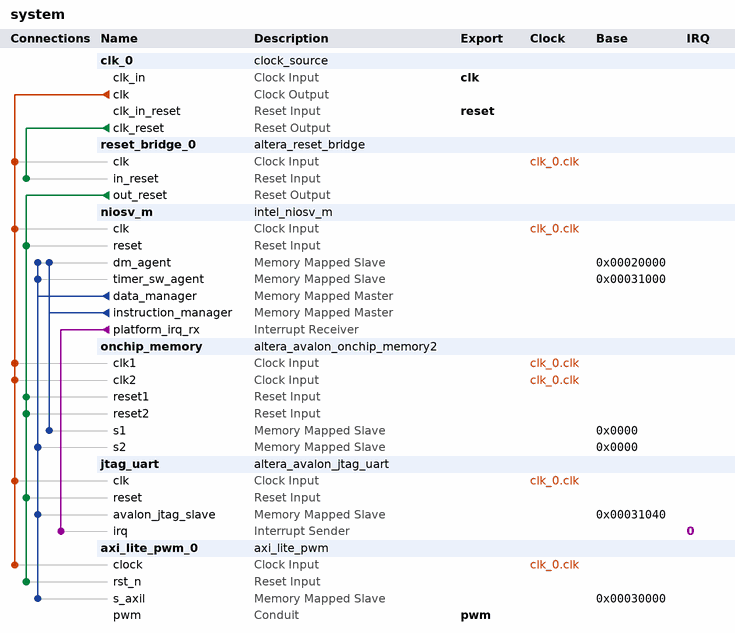
[diagram p0: system contents]
# Platform Designer (Qsys) system system, MAX 10 10M50DAF484C7G
# Parameters at their usual value, and those the tool derives, are not listed.
package require -exact qsys 25.1
create_system system
set_project_property DEVICE_FAMILY {MAX 10}
set_project_property DEVICE 10M50DAF484C7G

add_instance clk_0 clock_source 25.1
set_instance_parameter_value clk_0 clockFrequency 50000000

add_instance reset_bridge_0 altera_reset_bridge 25.1
set_instance_parameter_value reset_bridge_0 ACTIVE_LOW_RESET 1
set_instance_parameter_value reset_bridge_0 SYNCHRONOUS_EDGES deassert

add_instance niosv_m intel_niosv_m 26.0.0
set_instance_parameter_value niosv_m enableAvalonInterface false
set_instance_parameter_value niosv_m enableDebugReset false
set_instance_parameter_value niosv_m enableECCFull false
set_instance_parameter_value niosv_m enableECCLite false
set_instance_parameter_value niosv_m hartId 0
set_instance_parameter_value niosv_m interruptMode 0
set_instance_parameter_value niosv_m pipelineArch true
set_instance_parameter_value niosv_m resetSlave onchip_memory.s1

add_instance onchip_memory altera_avalon_onchip_memory2 25.1
set_instance_parameter_value onchip_memory dataWidth 32
set_instance_parameter_value onchip_memory dualPort true
set_instance_parameter_value onchip_memory initMemContent false
set_instance_parameter_value onchip_memory initializationFileName onchip_mem.hex
set_instance_parameter_value onchip_memory memorySize 131072

add_instance jtag_uart altera_avalon_jtag_uart 25.1
set_instance_parameter_value jtag_uart simInteractiveOptions NO_INTERACTIVE_WINDOWS

add_instance axi_lite_pwm_0 axi_lite_pwm 1.0
set_instance_parameter_value axi_lite_pwm_0 APPLY_ON_PERIOD_END true
set_instance_parameter_value axi_lite_pwm_0 AXI_ADDR_W 12
set_instance_parameter_value axi_lite_pwm_0 AXI_DATA_W 32
set_instance_parameter_value axi_lite_pwm_0 CNT_W 32

# connections
add_connection clk_0.clk axi_lite_pwm_0.clock clock
add_connection clk_0.clk jtag_uart.clk clock
add_connection clk_0.clk niosv_m.clk clock
add_connection clk_0.clk onchip_memory.clk1 clock
add_connection clk_0.clk onchip_memory.clk2 clock
add_connection clk_0.clk reset_bridge_0.clk clock
add_connection clk_0.clk_reset reset_bridge_0.in_reset reset
add_connection reset_bridge_0.out_reset axi_lite_pwm_0.rst_n reset
add_connection reset_bridge_0.out_reset jtag_uart.reset reset
add_connection reset_bridge_0.out_reset niosv_m.reset reset
add_connection reset_bridge_0.out_reset onchip_memory.reset1 reset
add_connection reset_bridge_0.out_reset onchip_memory.reset2 reset
add_connection niosv_m.data_manager axi_lite_pwm_0.s_axil avalon
set_connection_parameter_value niosv_m.data_manager/axi_lite_pwm_0.s_axil baseAddress 0x00030000
add_connection niosv_m.data_manager jtag_uart.avalon_jtag_slave avalon
set_connection_parameter_value niosv_m.data_manager/jtag_uart.avalon_jtag_slave baseAddress 0x00031040
add_connection niosv_m.data_manager niosv_m.dm_agent avalon
set_connection_parameter_value niosv_m.data_manager/niosv_m.dm_agent baseAddress 0x00020000
add_connection niosv_m.data_manager niosv_m.timer_sw_agent avalon
set_connection_parameter_value niosv_m.data_manager/niosv_m.timer_sw_agent baseAddress 0x00031000
add_connection niosv_m.data_manager onchip_memory.s2 avalon
set_connection_parameter_value niosv_m.data_manager/onchip_memory.s2 baseAddress 0x0000
add_connection niosv_m.instruction_manager niosv_m.dm_agent avalon
set_connection_parameter_value niosv_m.instruction_manager/niosv_m.dm_agent baseAddress 0x00020000
add_connection niosv_m.instruction_manager onchip_memory.s1 avalon
set_connection_parameter_value niosv_m.instruction_manager/onchip_memory.s1 baseAddress 0x0000
add_connection niosv_m.platform_irq_rx jtag_uart.irq interrupt
set_connection_parameter_value niosv_m.platform_irq_rx/jtag_uart.irq irqNumber 0

# exported interfaces
add_interface clk clock sink
set_interface_property clk EXPORT_OF clk_0.clk_in
add_interface pwm conduit end
set_interface_property pwm EXPORT_OF axi_lite_pwm_0.pwm
add_interface reset reset sink
set_interface_property reset EXPORT_OF clk_0.clk_in_reset

set_interconnect_requirement {$system} qsys_mm.clockCrossingAdapter HANDSHAKE
set_interconnect_requirement {$system} qsys_mm.enableEccProtection FALSE
set_interconnect_requirement {$system} qsys_mm.insertDefaultSlave FALSE
set_interconnect_requirement {$system} qsys_mm.maxAdditionalLatency 1

save_system system.qsys
